# EAGLE design quadparts (EAGLE 8.1.1)
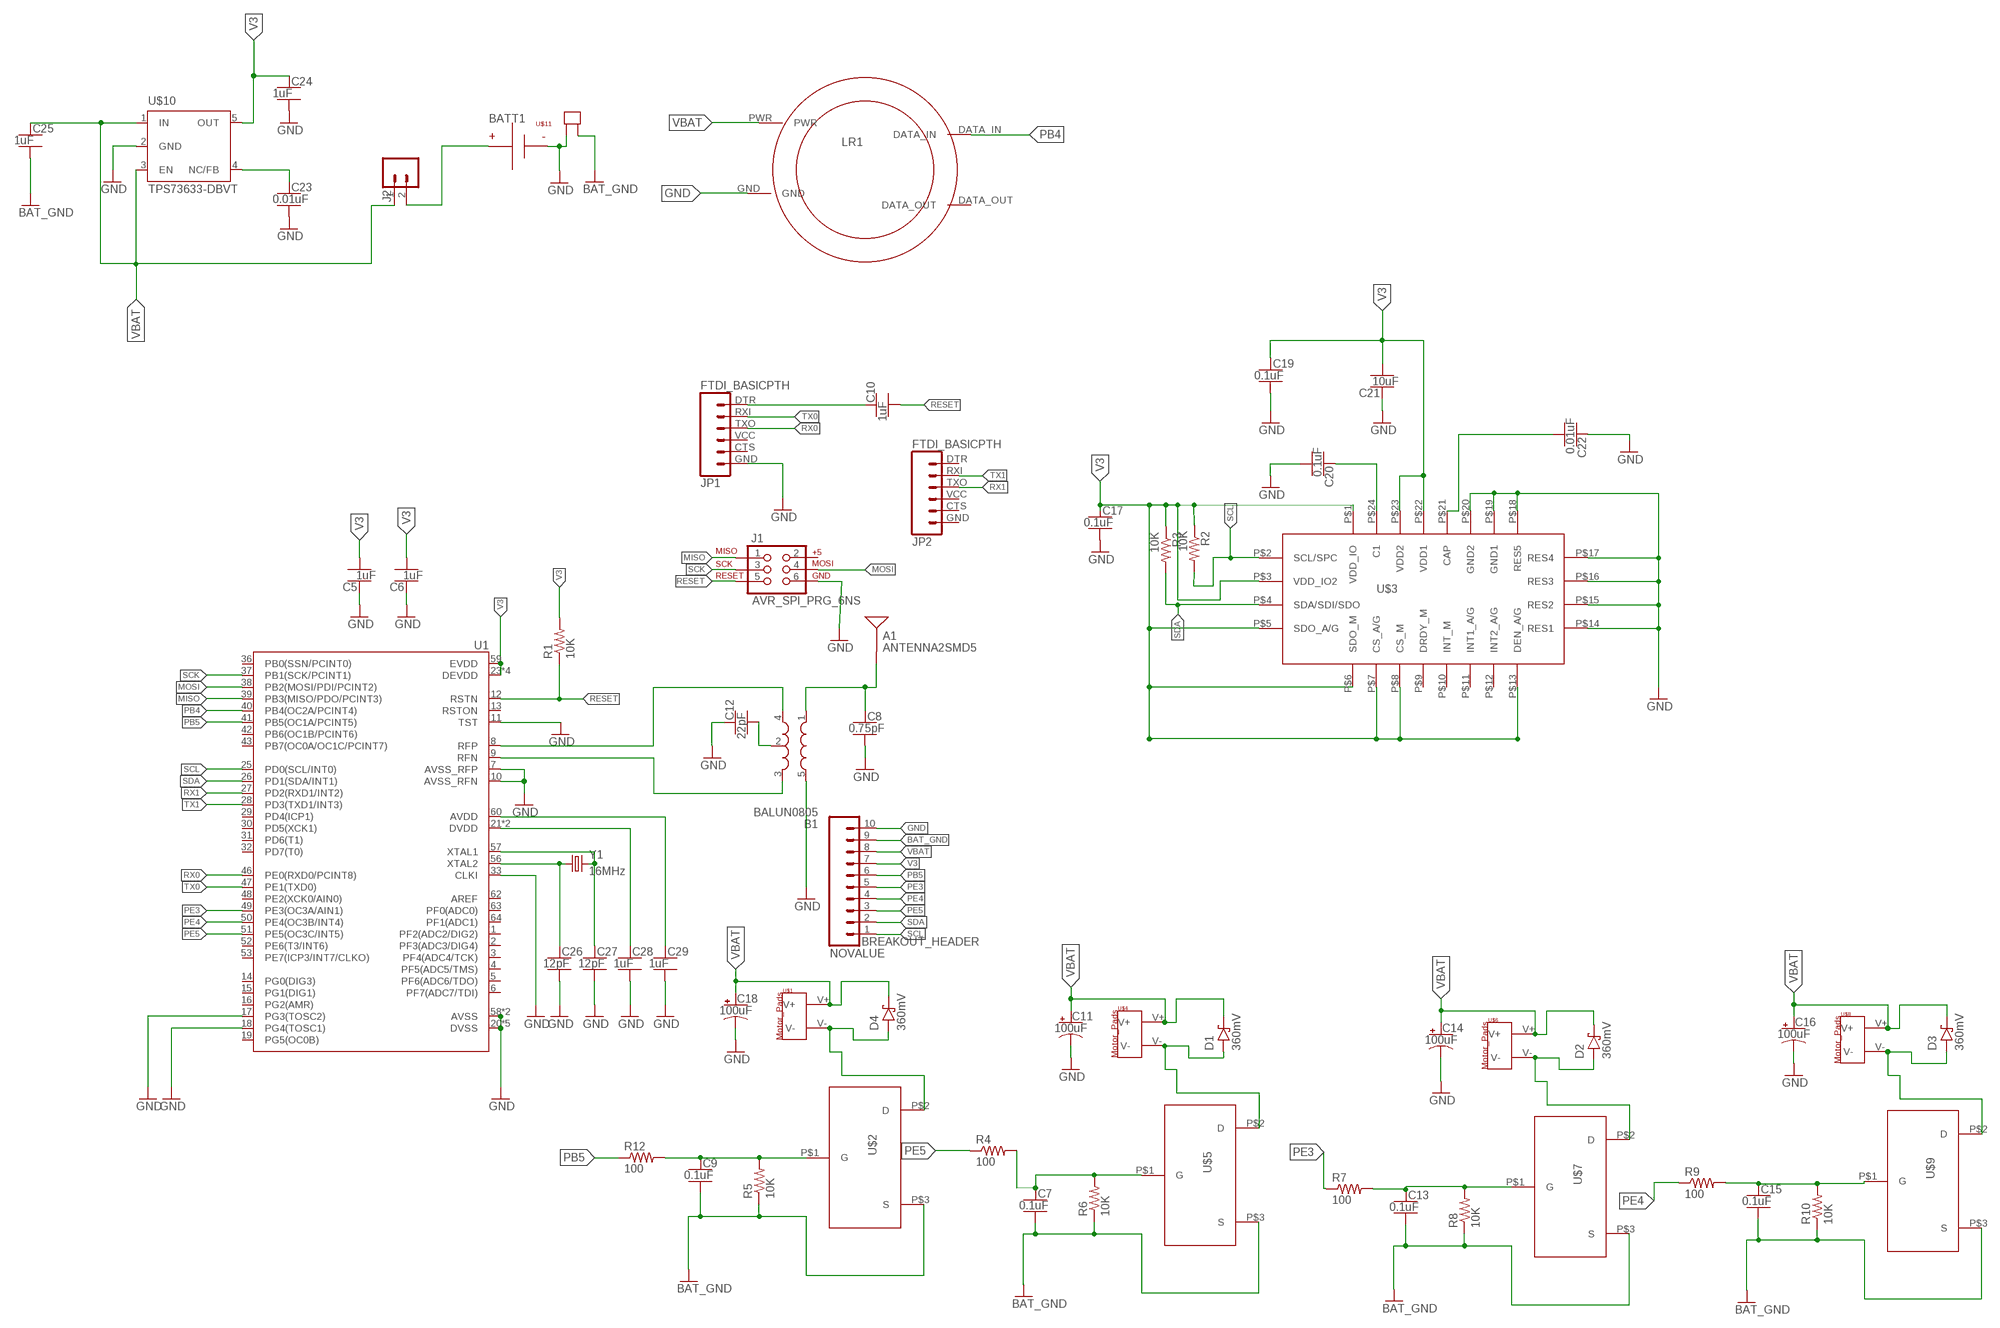
[diagram p0: schematic, sheet 1]

## Parts
A1  ANTENNA2SMD5  [ANTENNA-CHIP5]
B1  BALUN0805  [BALUN]
BATT1  BATTERY-HUBSAN-W/HOLDER  [BATTERY-W/HOLDER-380MAH-HUBSAN]
BREAKOUT_HEADER  NOVALUE  SIP-10_TH-254X10  [HDRV10W63P254_10X1_2540X254H838_HS]
C5  1uF  CAPACITOR-NP_SMD-2012-0805_CERAMIC-1UF  [CAPC2012X140_HS]
C6  1uF  CAPACITOR-NP_SMD-2012-0805_CERAMIC-1UF  [CAPC2012X140_HS]
C7  0.1uF  CERAMIC_CAP-0805-0.1UF  [CERAMIC_CAP_0805]
C8  0.75pF  CAPACITOR-NP_SMD-2012-0805_CERAMIC-0.75PF  [CAPC2012X140_HS]
C9  0.1uF  CERAMIC_CAP-0805-0.1UF  [CERAMIC_CAP_0805]
C10  1uF  CAPACITOR-NP_SMD-2012-0805_CERAMIC-1UF  [CAPC2012X140_HS]
C11  100uF  CAPACITOR-POL_SMD-7043-D_TANTALUM-220UF  [CAPMP7343X310_HS]
C12  22pF  CAPACITOR-NP_SMD-2012-0805_CERAMIC-22PF  [CAPC2012X140_HS]
C13  0.1uF  CERAMIC_CAP-0805-0.1UF  [CERAMIC_CAP_0805]
C14  100uF  CAPACITOR-POL_SMD-7043-D_TANTALUM-220UF  [CAPMP7343X310_HS]
C15  0.1uF  CERAMIC_CAP-0805-0.1UF  [CERAMIC_CAP_0805]
C16  100uF  CAPACITOR-POL_SMD-7043-D_TANTALUM-220UF  [CAPMP7343X310_HS]
C17  0.1uF  CAPACITOR-NP_SMD-2012-0805_CERAMIC-0.1UF  [CAPC2012X140_HS]
C18  100uF  CAPACITOR-POL_SMD-7043-D_TANTALUM-220UF  [CAPMP7343X310_HS]
C19  0.1uF  CAPACITOR-NP_SMD-2012-0805_CERAMIC-0.1UF  [CAPC2012X140_HS]
C20  0.1uF  CAPACITOR-NP_SMD-2012-0805_CERAMIC-0.1UF  [CAPC2012X140_HS]
C21  10uF  CAPACITOR-NP_SMD-2012-0805_CERAMIC-10UF  [CAPC2012X140_HS]
C22  0.01uF  CAPACITOR-NP_SMD-2012-0805_CERAMIC-0.01UF  [CAPC2012X140_HS]
C23  0.01uF  CAPACITOR-NP_SMD-2012-0805_CERAMIC-0.01UF  [CAPC2012X140_HS]
C24  1uF  CAPACITOR-NP_SMD-2012-0805_CERAMIC-1UF  [CAPC2012X140_HS]
C25  1uF  CAPACITOR-NP_SMD-2012-0805_CERAMIC-1UF  [CAPC2012X140_HS]
C26  12pF  CAPACITOR-NP_SMD-2012-0805_CERAMIC-12PF  [CAPC2012X140_HS]
C27  12pF  CAPACITOR-NP_SMD-2012-0805_CERAMIC-12PF  [CAPC2012X140_HS]
C28  1uF  CAPACITOR-NP_SMD-2012-0805_CERAMIC-1UF  [CAPC2012X140_HS]
C29  1uF  CAPACITOR-NP_SMD-2012-0805_CERAMIC-1UF  [CAPC2012X140_HS]
D1  360mV  DIODE-SCHOTTKY_SMD-SOD123-360MV  [SOD3716X135_HS]
D2  360mV  DIODE-SCHOTTKY_SMD-SOD123-360MV  [SOD3716X135_HS]
D3  360mV  DIODE-SCHOTTKY_SMD-SOD123-360MV  [SOD3716X135_HS]
D4  360mV  DIODE-SCHOTTKY_SMD-SOD123-360MV  [SOD3716X135_HS]
J1  AVR_SPI_PRG_6NS  [2X3-NS]
J2  MALE_HEADER_2POS-2X1-0.1IN  [MALE_HEADER_2X1_0.1IN]
JP1  FTDI_BASICPTH  [FTDI_BASIC]
JP2  FTDI_BASICPTH  [FTDI_BASIC]
LR1  LED_RING  [LED_RING]
R1  10K  RESISTOR_SMD-2012-0805-10K  [RESC2012X60_HS]
R2  10K  RESISTOR_SMD-2012-0805-10K  [RESC2012X60_HS]
R3  10K  RESISTOR_SMD-2012-0805-10K  [RESC2012X60_HS]
R4  100  RESISTOR_SMD-2012-0805-100  [RESC2012X60_HS]
R5  10K  RESISTOR_SMD-2012-0805-10K  [RESC2012X60_HS]
R6  10K  RESISTOR_SMD-2012-0805-10K  [RESC2012X60_HS]
R7  100  RESISTOR_SMD-2012-0805-100  [RESC2012X60_HS]
R8  10K  RESISTOR_SMD-2012-0805-10K  [RESC2012X60_HS]
R9  100  RESISTOR_SMD-2012-0805-100  [RESC2012X60_HS]
R10  10K  RESISTOR_SMD-2012-0805-10K  [RESC2012X60_HS]
R12  100  RESISTOR_SMD-2012-0805-100  [RESC2012X60_HS]
U1  ATMEGA128RFA1  [QFN-64]
U$1  MOTOR_PADS  [MOTOR_PADS]
U$2  N-CHANNEL_MOSFET  [N-CHANNELMOFSET]
U$3  9-AXIS_IMU  [9-AXIS_IMU]
U$4  MOTOR_PADS  [MOTOR_PADS]
U$5  N-CHANNEL_MOSFET  [N-CHANNELMOFSET]
U$6  MOTOR_PADS  [MOTOR_PADS]
U$7  N-CHANNEL_MOSFET  [N-CHANNELMOFSET]
U$8  MOTOR_PADS  [MOTOR_PADS]
U$9  N-CHANNEL_MOSFET  [N-CHANNELMOFSET]
U$10  TPS73633-DBVT  [SOT23-DBV]
U$11  NET_BRIDGE  [NET_BRIDGE]
Y1  16MHz  CRYSTAL5X3  [CRYSTAL-SMD-5X3]

## Nets
BAT_GND: BREAKOUT_HEADER.9 C7.2 C9.2 C13.2 C15.2 C25.2 R5.1 R6.1 R8.1 R10.1 U$2.P$3(S) U$5.P$3(S) U$7.P$3(S) U$9.P$3(S) U$11.P$2
GND: B1.5(GND) BATT1.-(N) BREAKOUT_HEADER.10 C5.1 C6.1 C8.2 C11.2(-) C12.1 C14.2(-) C16.2(-) C17.2 C18.2(-) C19.2 C20.2 C21.1 C22.1 C23.2 C24.2 C26.2 C27.2 C28.2 C29.2 J1.6 JP1.GND LR1.GND U1.7(AVSS_RFP) U1.10(AVSS_RFN) U1.11(TST) U1.17(PG3(TOSC2)) U1.18(PG4(TOSC1)) U1.20(DVSS) U1.24(DVSS) U1.33(CLKI) U1.35(DVSS) U1.45(DVSS) U1.55(DVSS) U1.58(AVSS) U1.61(AVSS) U$3.P$14(RES1) U$3.P$15(RES2) U$3.P$16(RES3) U$3.P$17(RES4) U$3.P$18(RES5) U$3.P$19(GND1) U$3.P$20(GND2) U$10.2(GND) U$11.P$1
MISO: J1.1 U1.39(PB3(MISO/PDO/PCINT3))
MOSI: J1.4 U1.38(PB2(MOSI/PDI/PCINT2))
N$1: C9.1 R5.2 R12.2 U$2.P$1(G)
N$2: C7.1 R4.2 R6.2 U$5.P$1(G)
N$4 [RFSIG]: A1.FEED(SIGNAL) B1.1(IN) C8.1
N$8: B1.2(GND) C12.2
N$10: C10.1 JP1.DTR
N$13: D1.A U$4.V- U$5.P$2(D)
N$14: C13.1 R7.2 R8.2 U$7.P$1(G)
N$16: D4.A U$1.V- U$2.P$2(D)
N$17 [HIGHCURRENT]: D2.A U$6.V- U$7.P$2(D)
N$18: C15.1 R9.2 R10.2 U$9.P$1(G)
N$19: D3.A U$8.V- U$9.P$2(D)
N$21: C20.1 U$3.P$24(C1)
N$23: C22.2 U$3.P$21(CAP)
N$24: C26.1 U1.56(XTAL2) Y1.1
N$25: BATT1.+(P) J2.2
N$26: C16.1(+) D3.C U$8.V+
N$27: C23.1 U$10.4(NC/FB)
N$36: B1.4(OUT1) U1.8(RFP)
N$37: B1.3(OUT2) U1.9(RFN)
N$40: C29.1 U1.60(AVDD)
N$41: C28.1 U1.21(DVDD) U1.22(DVDD)
N$43: C27.1 U1.57(XTAL1) Y1.3
PB4: LR1.DATA_IN U1.40(PB4(OC2A/PCINT4))
PB5: BREAKOUT_HEADER.6 R12.1 U1.41(PB5(OC1A/PCINT5))
PE3: BREAKOUT_HEADER.5 R7.1 U1.49(PE3(OC3A/AIN1))
PE4: BREAKOUT_HEADER.4 R9.1 U1.50(PE4(OC3B/INT4))
PE5: BREAKOUT_HEADER.3 R4.1 U1.51(PE5(OC3C/INT5))
RESET: C10.2 J1.5 R1.1 U1.12(RSTN)
RX0: JP1.TXO U1.46(PE0(RXD0/PCINT8))
RX1: JP2.TXO U1.27(PD2(RXD1/INT2))
SCK: J1.3 U1.37(PB1(SCK/PCINT1))
SCL: BREAKOUT_HEADER.1 R2.2 U1.25(PD0(SCL/INT0)) U$3.P$2(SCL/SPC)
SDA: BREAKOUT_HEADER.2 R3.2 U1.26(PD1(SDA/INT1)) U$3.P$4(SDA/SDI/SDO)
TX0: JP1.RXI U1.47(PE1(TXD0))
TX1: JP2.RXI U1.28(PD3(TXD1/INT3))
V3: BREAKOUT_HEADER.7 C5.2 C6.2 C17.1 C19.1 C21.2 C24.1 R1.2 R2.1 R3.1 U1.23(DEVDD) U1.34(DEVDD) U1.44(DEVDD) U1.54(DEVDD) U1.59(EVDD) U$3.P$1(VDD_IO) U$3.P$3(VDD_IO2) U$3.P$5(SDO_A/G) U$3.P$6(SDO_M) U$3.P$7(CS_A/G) U$3.P$8(CS_M) U$3.P$13(DEN_A/G) U$3.P$22(VDD1) U$3.P$23(VDD2) U$10.5(OUT)
VBAT [HIGHCURRENT]: BREAKOUT_HEADER.8 C11.1(+) C14.1(+) C18.1(+) C25.1 D1.C D2.C D4.C J2.1 LR1.PWR U$1.V+ U$4.V+ U$6.V+ U$10.1(IN) U$10.3(EN)
Unconnected: J1.2 JP1.CTS JP1.VCC JP2.CTS JP2.DTR JP2.GND JP2.VCC LR1.DATA_OUT U1.1(PF2(ADC2/DIG2)) U1.2(PF3(ADC3/DIG4)) U1.3(PF4(ADC4/TCK)) U1.4(PF5(ADC5/TMS)) U1.5(PF6(ADC6/TDO)) U1.6(PF7(ADC7/TDI)) U1.13(RSTON) U1.14(PG0(DIG3)) U1.15(PG1(DIG1)) U1.16(PG2(AMR)) U1.19(PG5(OC0B)) U1.29(PD4(ICP1)) U1.30(PD5(XCK1)) U1.31(PD6(T1)) U1.32(PD7(T0)) U1.36(PB0(SSN/PCINT0)) U1.42(PB6(OC1B/PCINT6)) U1.43(PB7(OC0A/OC1C/PCINT7)) U1.48(PE2(XCK0/AIN0)) U1.52(PE6(T3/INT6)) U1.53(PE7(ICP3/INT7/CLKO)) U1.62(AREF) U1.63(PF0(ADC0)) U1.64(PF1(ADC1)) U$3.P$9(DRDY_M) U$3.P$10(INT_M) U$3.P$11(INT1_A/G) U$3.P$12(INT2_A/G)

## Library data of the parts
A1 = quadparts_prebuilt:ANTENNA2: Chip antenna Single endded antenna. Common with smaller chip antennas. CHIP4 package is the GPS Chip Antenna SKU: GPS-08418. CHIP5 package is 2.4GHz chip antenna SKU: WRL-00144.; DATASHEET: http://www.linxtechnologies.com/resources/data-guides/ant-xxx-chp-x.pdf; DIST: Digikey; DISTPN: ANT-2.45-CHPCT-ND; MFR: Linx Technologies Inc.; MPN: ANT-2.45-CHP-T; PRICE: 3.16
B1 = quadparts_prebuilt:BALUN: 0805 footprint balun- Ember 351/357; DATASHEET: http://katalog.we-online.de/pbs/datasheet/748421245.pdf; DIST: Digikey; DISTPN: 732-2230-6-ND; MFR: Wurth Electronics Inc; MPN: 748421245; PRICE: 2.63
BATT1 = quadparts_prebuilt:BATTERY; CREATOR: Swanson; DIST: AMAZON; DISTPN: http://www.amazon.com/dp/B00RROB6Q4?smid=AMNTPWSAB5H0S; MFR: HUBSAN; MPN: X4-H107C-8-in-1
BREAKOUT_HEADER = quadparts_prebuilt:SIP-10_: 10 pin single inline pin header, socket, or connector; DATASHEET: http://portal.fciconnect.com/Comergent//fci/drawing/68000.pdf; DIST: Digikey; DISTPN: 609-3250-ND; MFR: Amphenol FCI; MPN: 68000-110HLF; PRICE: 0.55
C5 C6 C10 C24 C25 C28 C29 = quadparts_prebuilt:CAPACITOR-NP_: Nonpolarized capacitor; DIST: Digikey; DISTPN: 490-4736-1-ND; MFR: Murata Electronics North America; MPN: GRM21BR71H105KA12L
C7 C9 C13 C15 = quadparts_Jason:CERAMIC_CAP: Nonpolarized capacitor; CREATOR: SWANSON; DIST: Digikey; DISTPN: 490-1666-1-ND; MFR: Murata Electronics North America; MPN: GRM21BR71H104KA01L
C8 = quadparts_prebuilt:CAPACITOR-NP_: Nonpolarized capacitor; DIST: Digikey; DISTPN: 490-3585-1-ND; MFR: Murata Electronics North America; MPN: GQM2195C2AR75CB01D
C11 C14 C16 C18 = quadparts_prebuilt:CAPACITOR-POL_: Polarized capacitor; DIST: Digikey; DISTPN: 478-8912-1-ND; MFR: AVX Corporation; MPN: TAJD227K006RNJ; VALUE: 220uF
C12 = quadparts_prebuilt:CAPACITOR-NP_: Nonpolarized capacitor; DIST: Digikey; DISTPN: 490-5534-1-ND; MFR: Murata Electronics North America; MPN: GRM21A5C2E220JW01D
C17 C19 C20 = quadparts_prebuilt:CAPACITOR-NP_: Nonpolarized capacitor; DIST: Digikey; DISTPN: 490-1666-1-ND; MFR: Murata Electronics North America; MPN: GRM21BR71H104KA01L
C21 = quadparts_prebuilt:CAPACITOR-NP_: Nonpolarized capacitor; DIST: Digikey; DISTPN: 490-5523-1-ND; MFR: Murata Electronics North America; MPN: GRM21BR61E106KA73L
C22 C23 = quadparts_prebuilt:CAPACITOR-NP_: Nonpolarized capacitor; DIST: Digikey; DISTPN: 490-8295-1-ND; MFR: Murata Electronics North America; MPN: GRM2195C1H103FA01D
C26 C27 = quadparts_prebuilt:CAPACITOR-NP_: Nonpolarized capacitor; DIST: Digikey; DISTPN: 490-5531-1-ND; MFR: Murata Electronics North America; MPN: GRM21A5C2E120JW01D
D1-D4 = quadparts_prebuilt:DIODE-SCHOTTKY_: Schottky diode; DIST: Digikey; DISTPN: CRS08QMCT-ND; MFR: Toshiba Semiconductor and Storage; MPN: CRS08(TE85L,Q,M)
J1 = quadparts_prebuilt:AVR_SPI_PRG_6: AVR ISP 6 Pin This is the reduced ISP connector for AVR programming. Common on Arduino. This footprint will take up less PCB space and can be used with a 10-pin to 6-pin adapter such as SKU: BOB-08508; DATASHEET: http://portal.fciconnect.com/Comergent//fci/drawing/67996.pdf; DIST: Digikey; DISTPN: 609-3234-ND; MFR: Amphenol FCI; MPN: 67997-206HLF; PRICE: 0.31
J2 = quadparts_Jason:MALE_HEADER_2POS: 2 pin single inline pin header, socket, or connector; CREATOR: SWANSON; DIST: Digikey; DISTPN: 3M9447-ND; MFR: 3M; MPN: 961102-6404-AR
JP1 JP2 = quadparts_prebuilt:FTDI_BASIC: FTDI Basic header with labels; DATASHEET: http://portal.fciconnect.com/Comergent//fci/drawing/68015.pdf; DIST: Digikey; DISTPN: 609-3327-ND; MFR: Amphenol FCI; MPN: 68016-406HLF; PRICE: 0.33
LR1 = LEDs:LED_RING
R1-R3 R5 R6 R8 R10 = quadparts_prebuilt:RESISTOR_: Resistor; DIST: Digikey; DISTPN: 311-10KARCT-ND; MFR: Yageo; MPN: RC0805JR-0710KL
R4 R7 R9 R12 = quadparts_prebuilt:RESISTOR_: Resistor; DIST: Digikey; DISTPN: 311-100ARCT-ND; MFR: Yageo; MPN: RC0805JR-07100RL
U1 = quadparts_prebuilt:ATMEGA128RFA1: ATmega128RFA1 8-bit AVR Microcontroller with Low Power 2.4GHz Transceiver for ZigBee and IEEE 802.15.4; CREATOR: Swanson; DATASHEET: http://www.atmel.com/Images/Atmel-8266-MCU_Wireless-ATmega128RFA1_Datasheet.pdf; DIST: Digikey; DISTPN: ATMEGA128RFA1-ZUR00DKR-ND; MFR: Atmel; MPN: ATMEGA128RFA1-ZUR00; PRICE: 10.21
U$1 U$4 U$6 U$8 = quadparts_prebuilt:MOTOR_PADS; DIST: NA; DISTPN: NA; MFR: NA; MPN: NA
U$2 U$5 U$7 U$9 = quadparts_Jason:N-CHANNEL_MOSFET; CREATOR: Jason_Wong; DIST: Digikey; DISTPN: SI2302CDS-T1-E3CT-ND; MFR: Vishay Siliconix; MPN: SI2302CDS-T1-E3
U$3 = quadparts_Jason:9-AXIS_IMU; CREATOR: Jason_Wong; DIST: Digikey; DISTPN: 497-14946-1-ND; MFR: STMicroelectronics; MPN: LSM9DS1TR
U$10 = quadparts_prebuilt:TPS73633-DBVT; DATASHEET: http://www.ti.com/lit/ds/symlink/lp3985.pdf; DIST: Digikey; DISTPN: LP3985IM5X-3.0/NOPBCT-ND; MFR: Texas Instruments; MPN: LP3985IM5X-3.0/NOPB; PRICE: 0.59
U$11 = quadparts_Zhe:NET_BRIDGE
Y1 = quadparts_prebuilt:CRYSTAL: Various standard crystals. Proven footprints.; DATASHEET: http://www.abracon.com/Resonators/abm3b.pdf; DIST: Digikey; DISTPN: 535-9122-1-ND; MFR: Abracon LLC; MPN: ABM3B-16.000MHZ-B2-T; PRICE: 0.68; PROD_ID: XTAL-08218

## Net classes
1 RFSIG: width 0.457 mm
2 HIGHCURRENT: width 0.457 mm

## Board
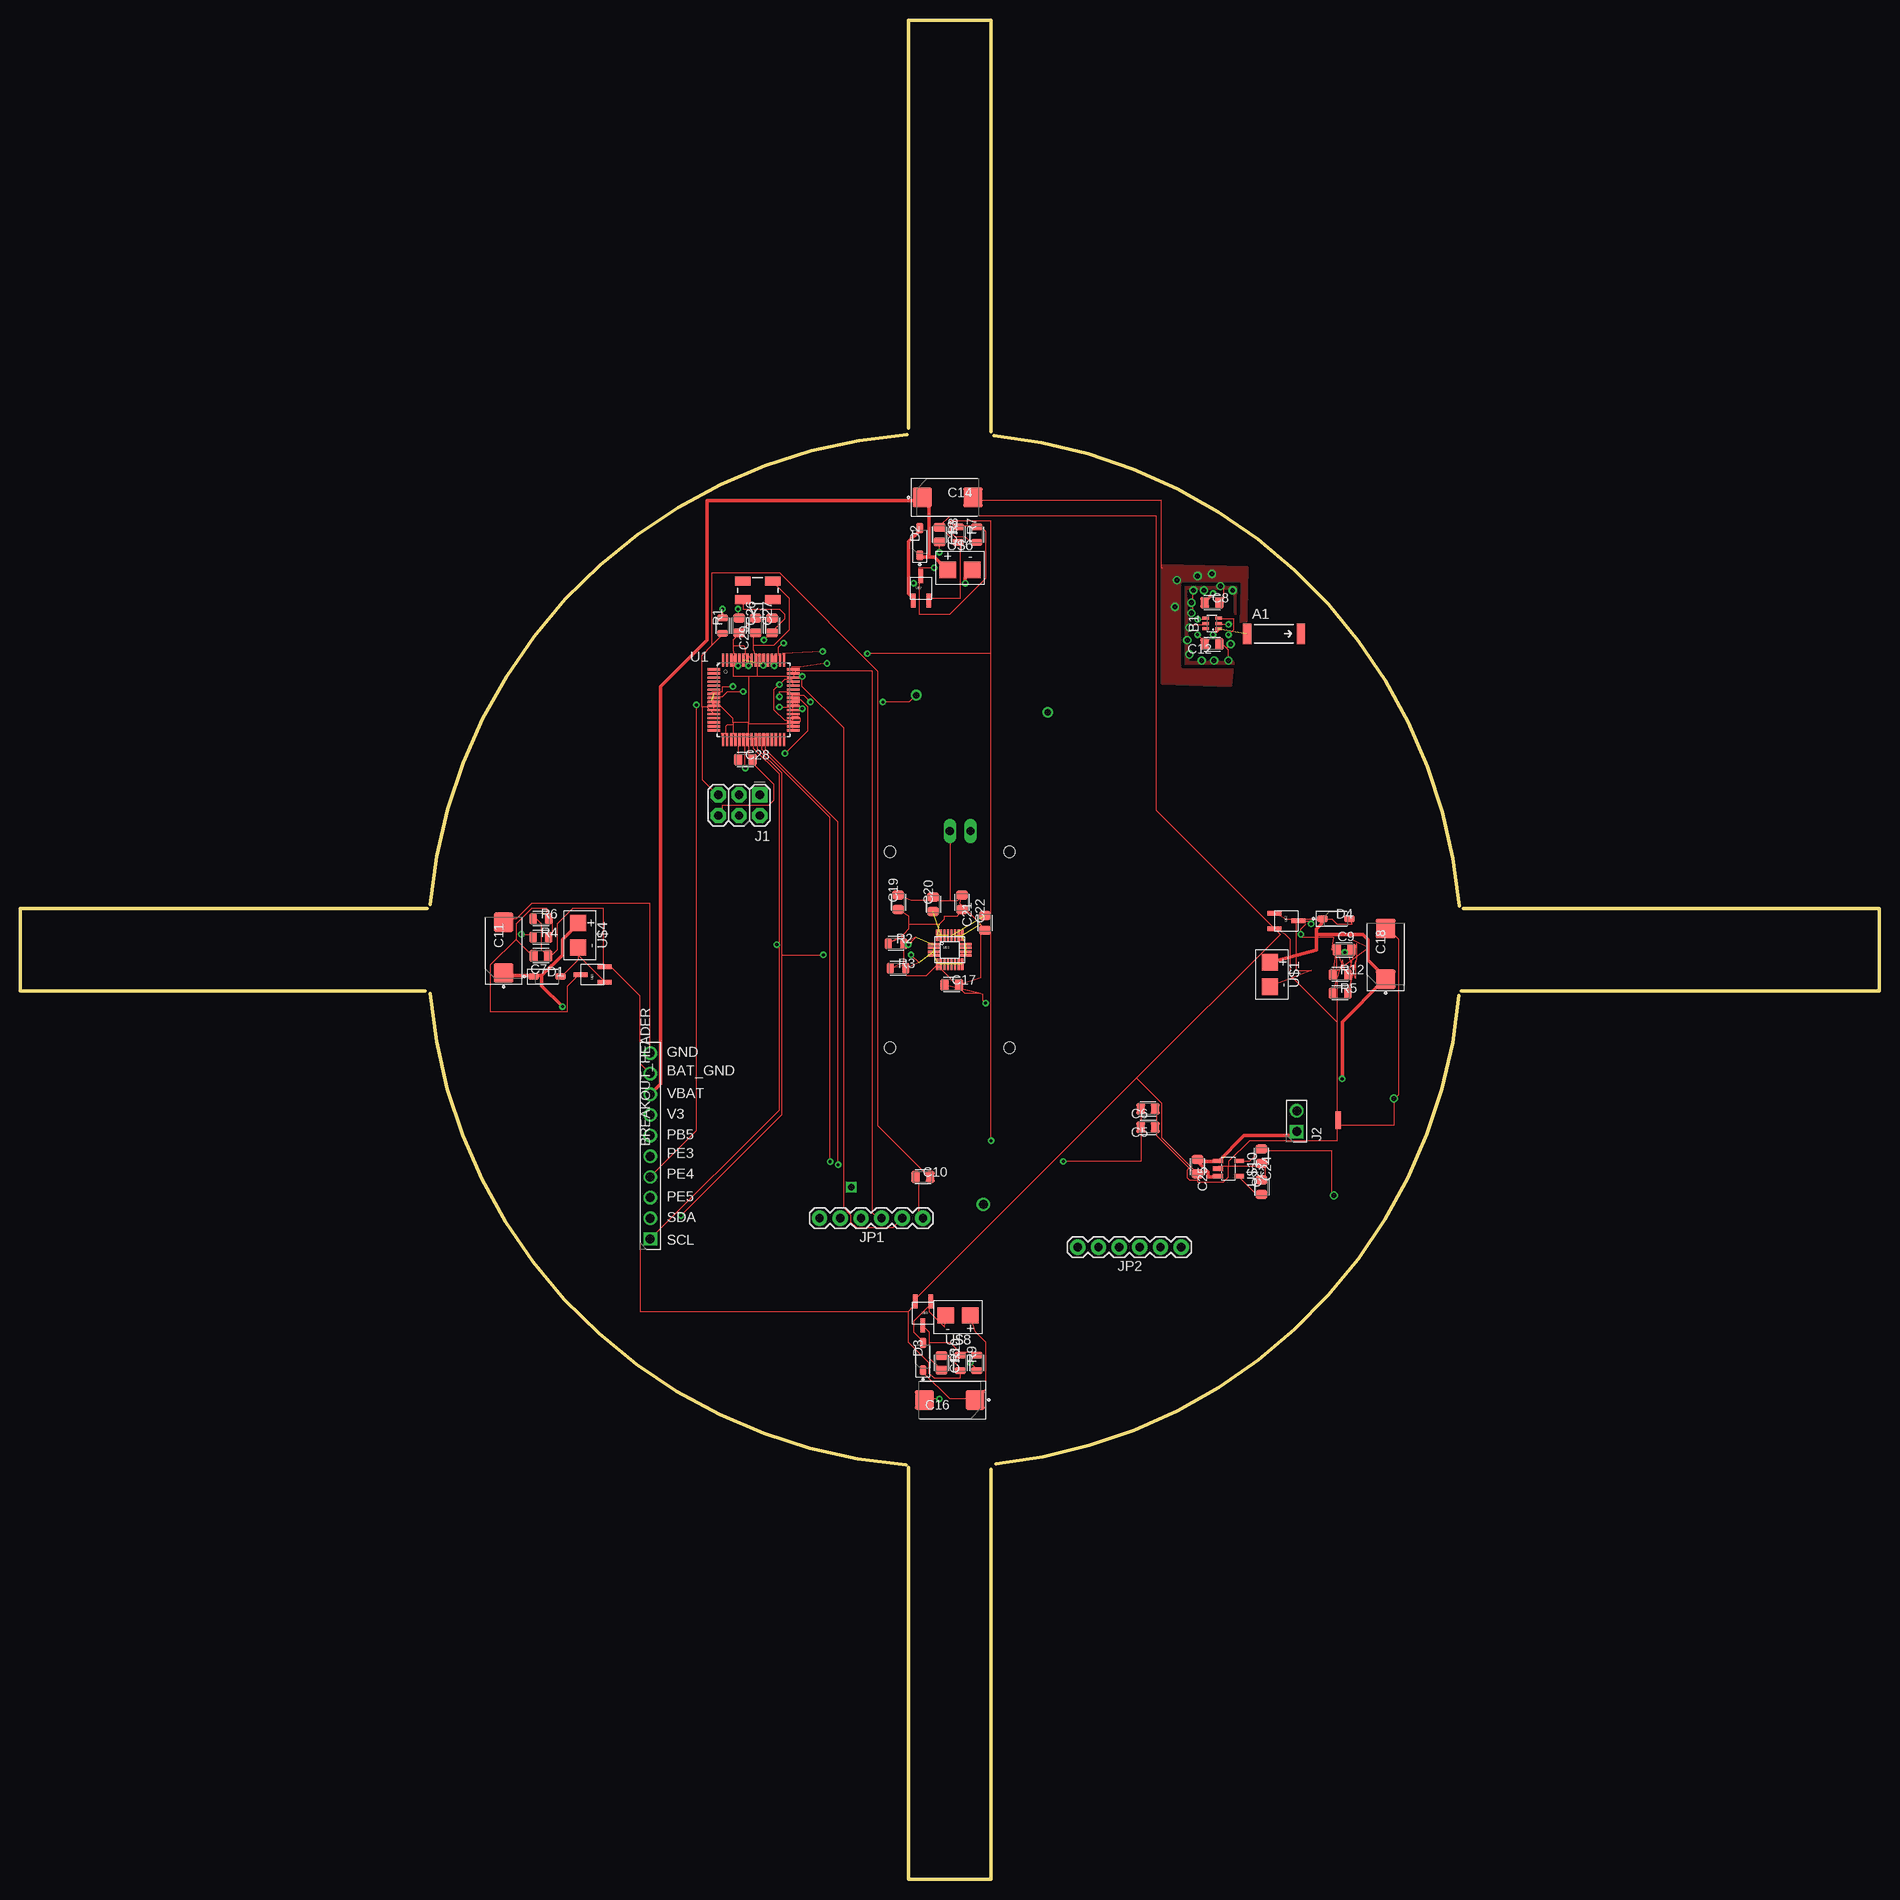
[diagram p1: board, top side]
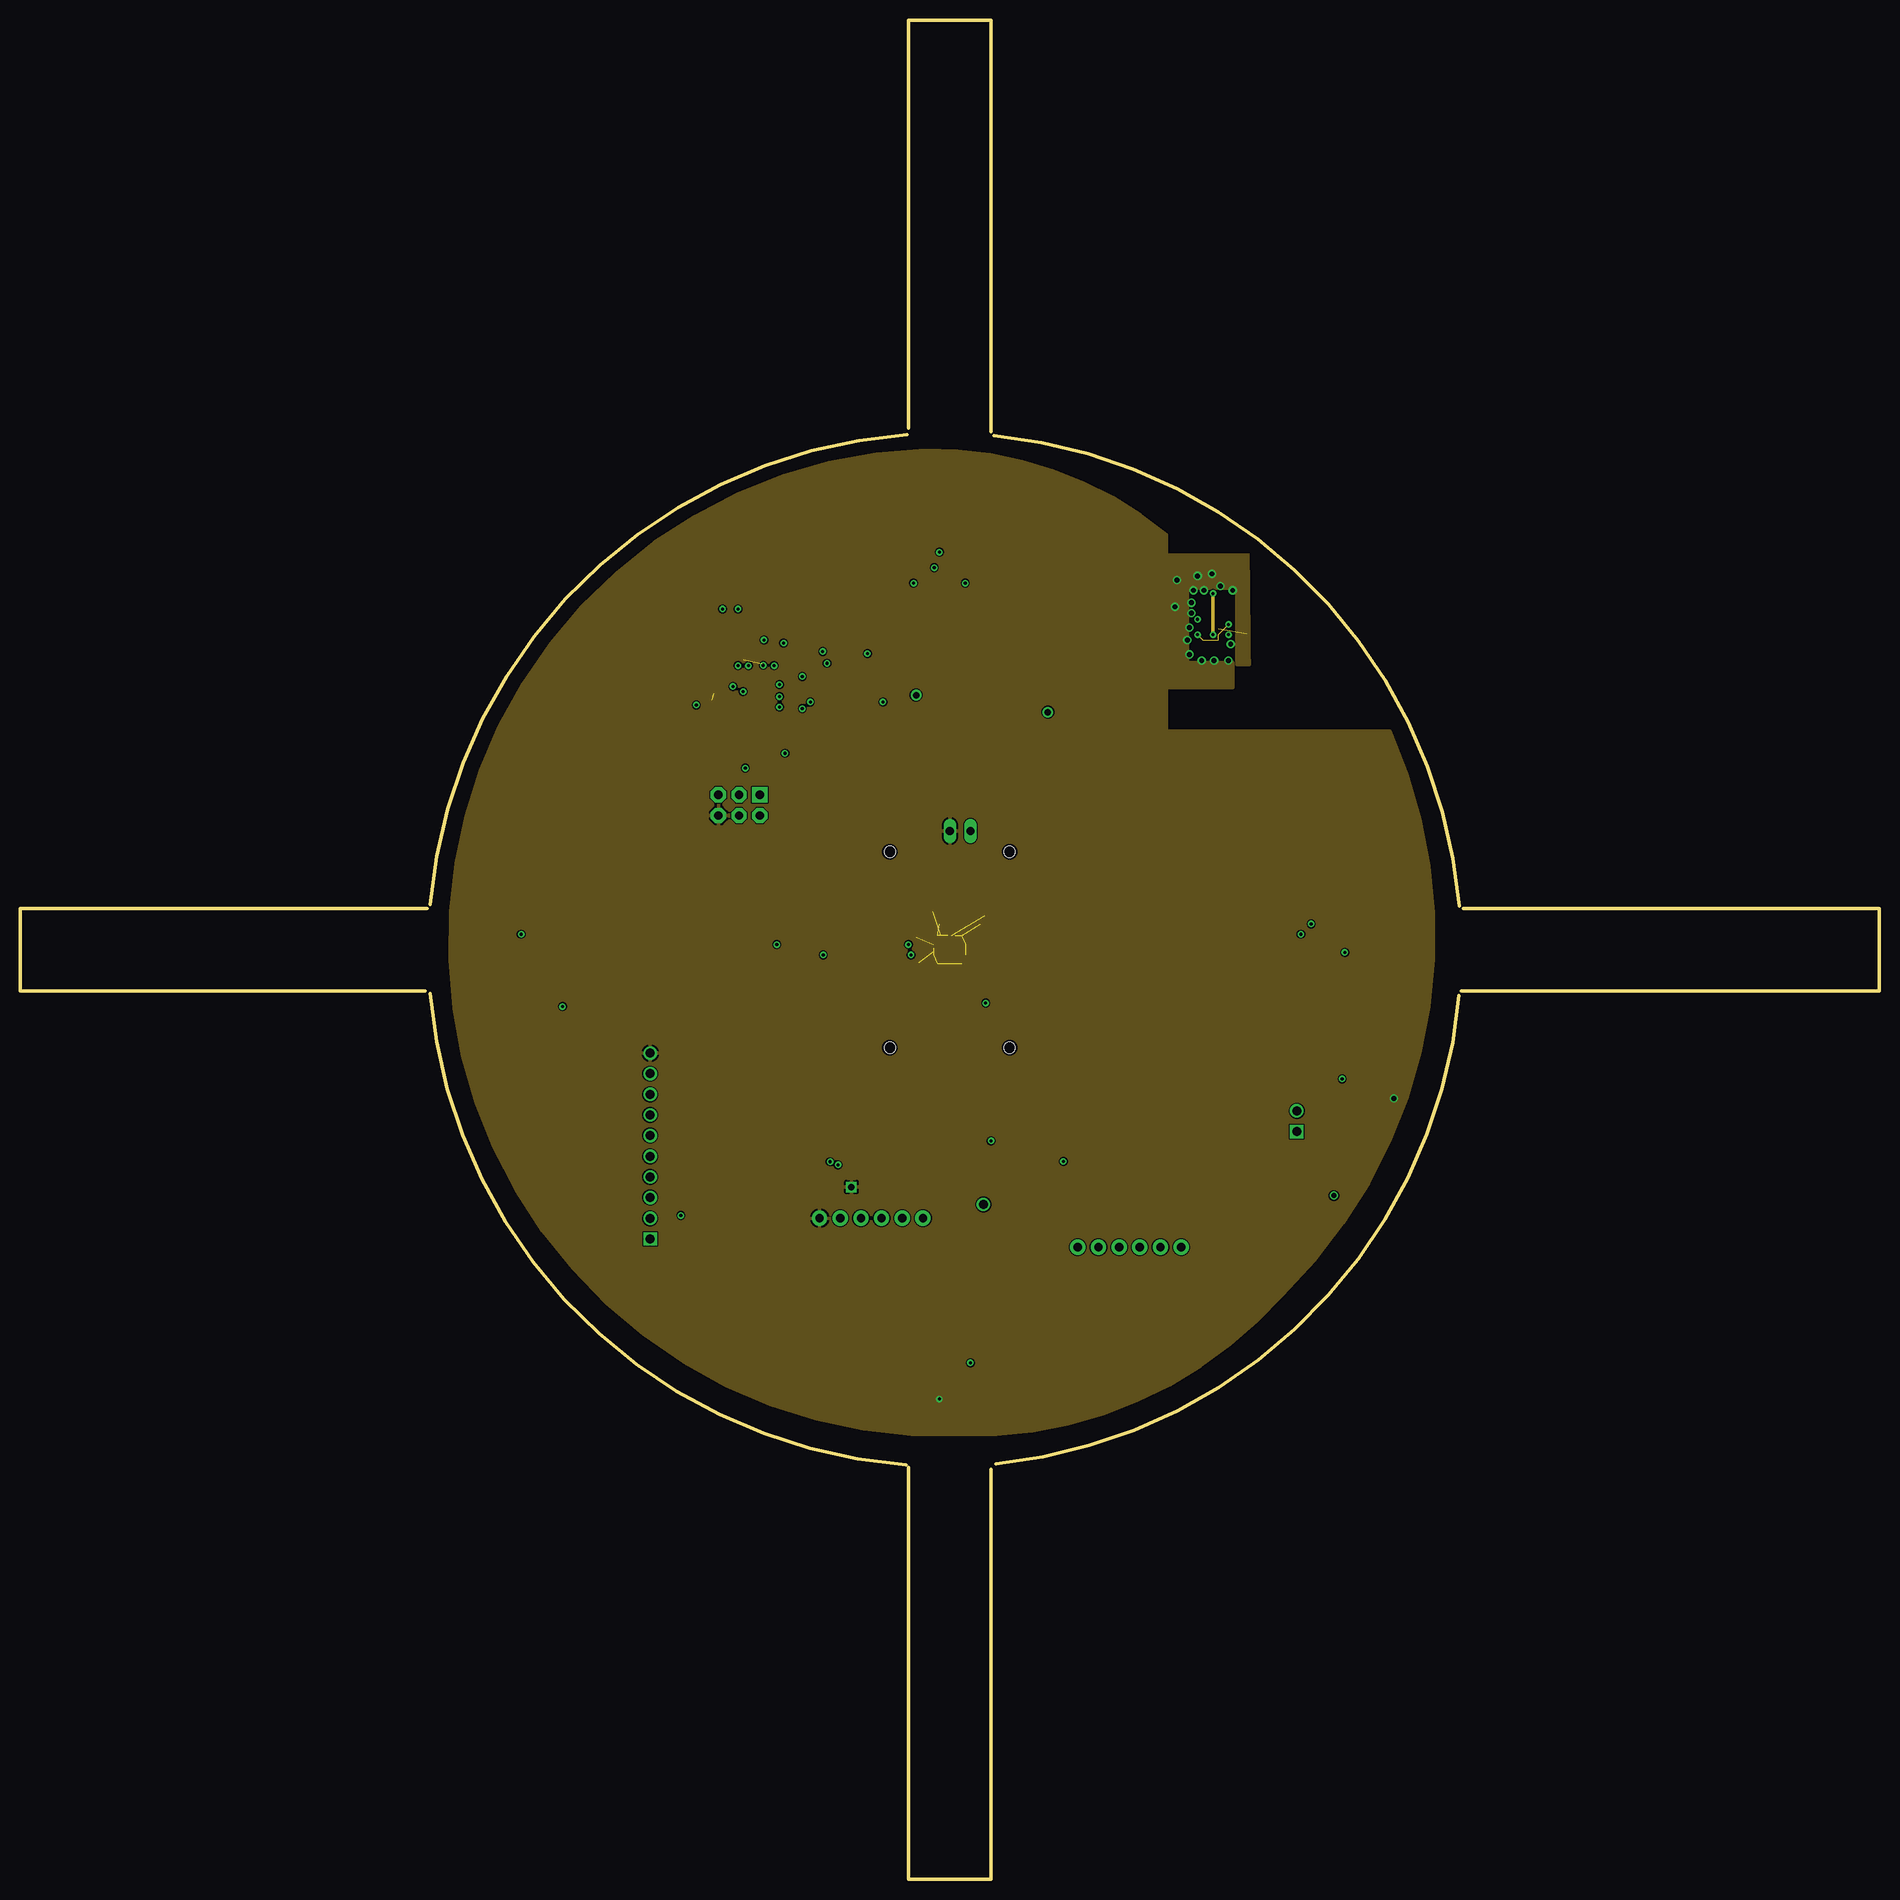
[diagram p2: board, inner layer Route2]
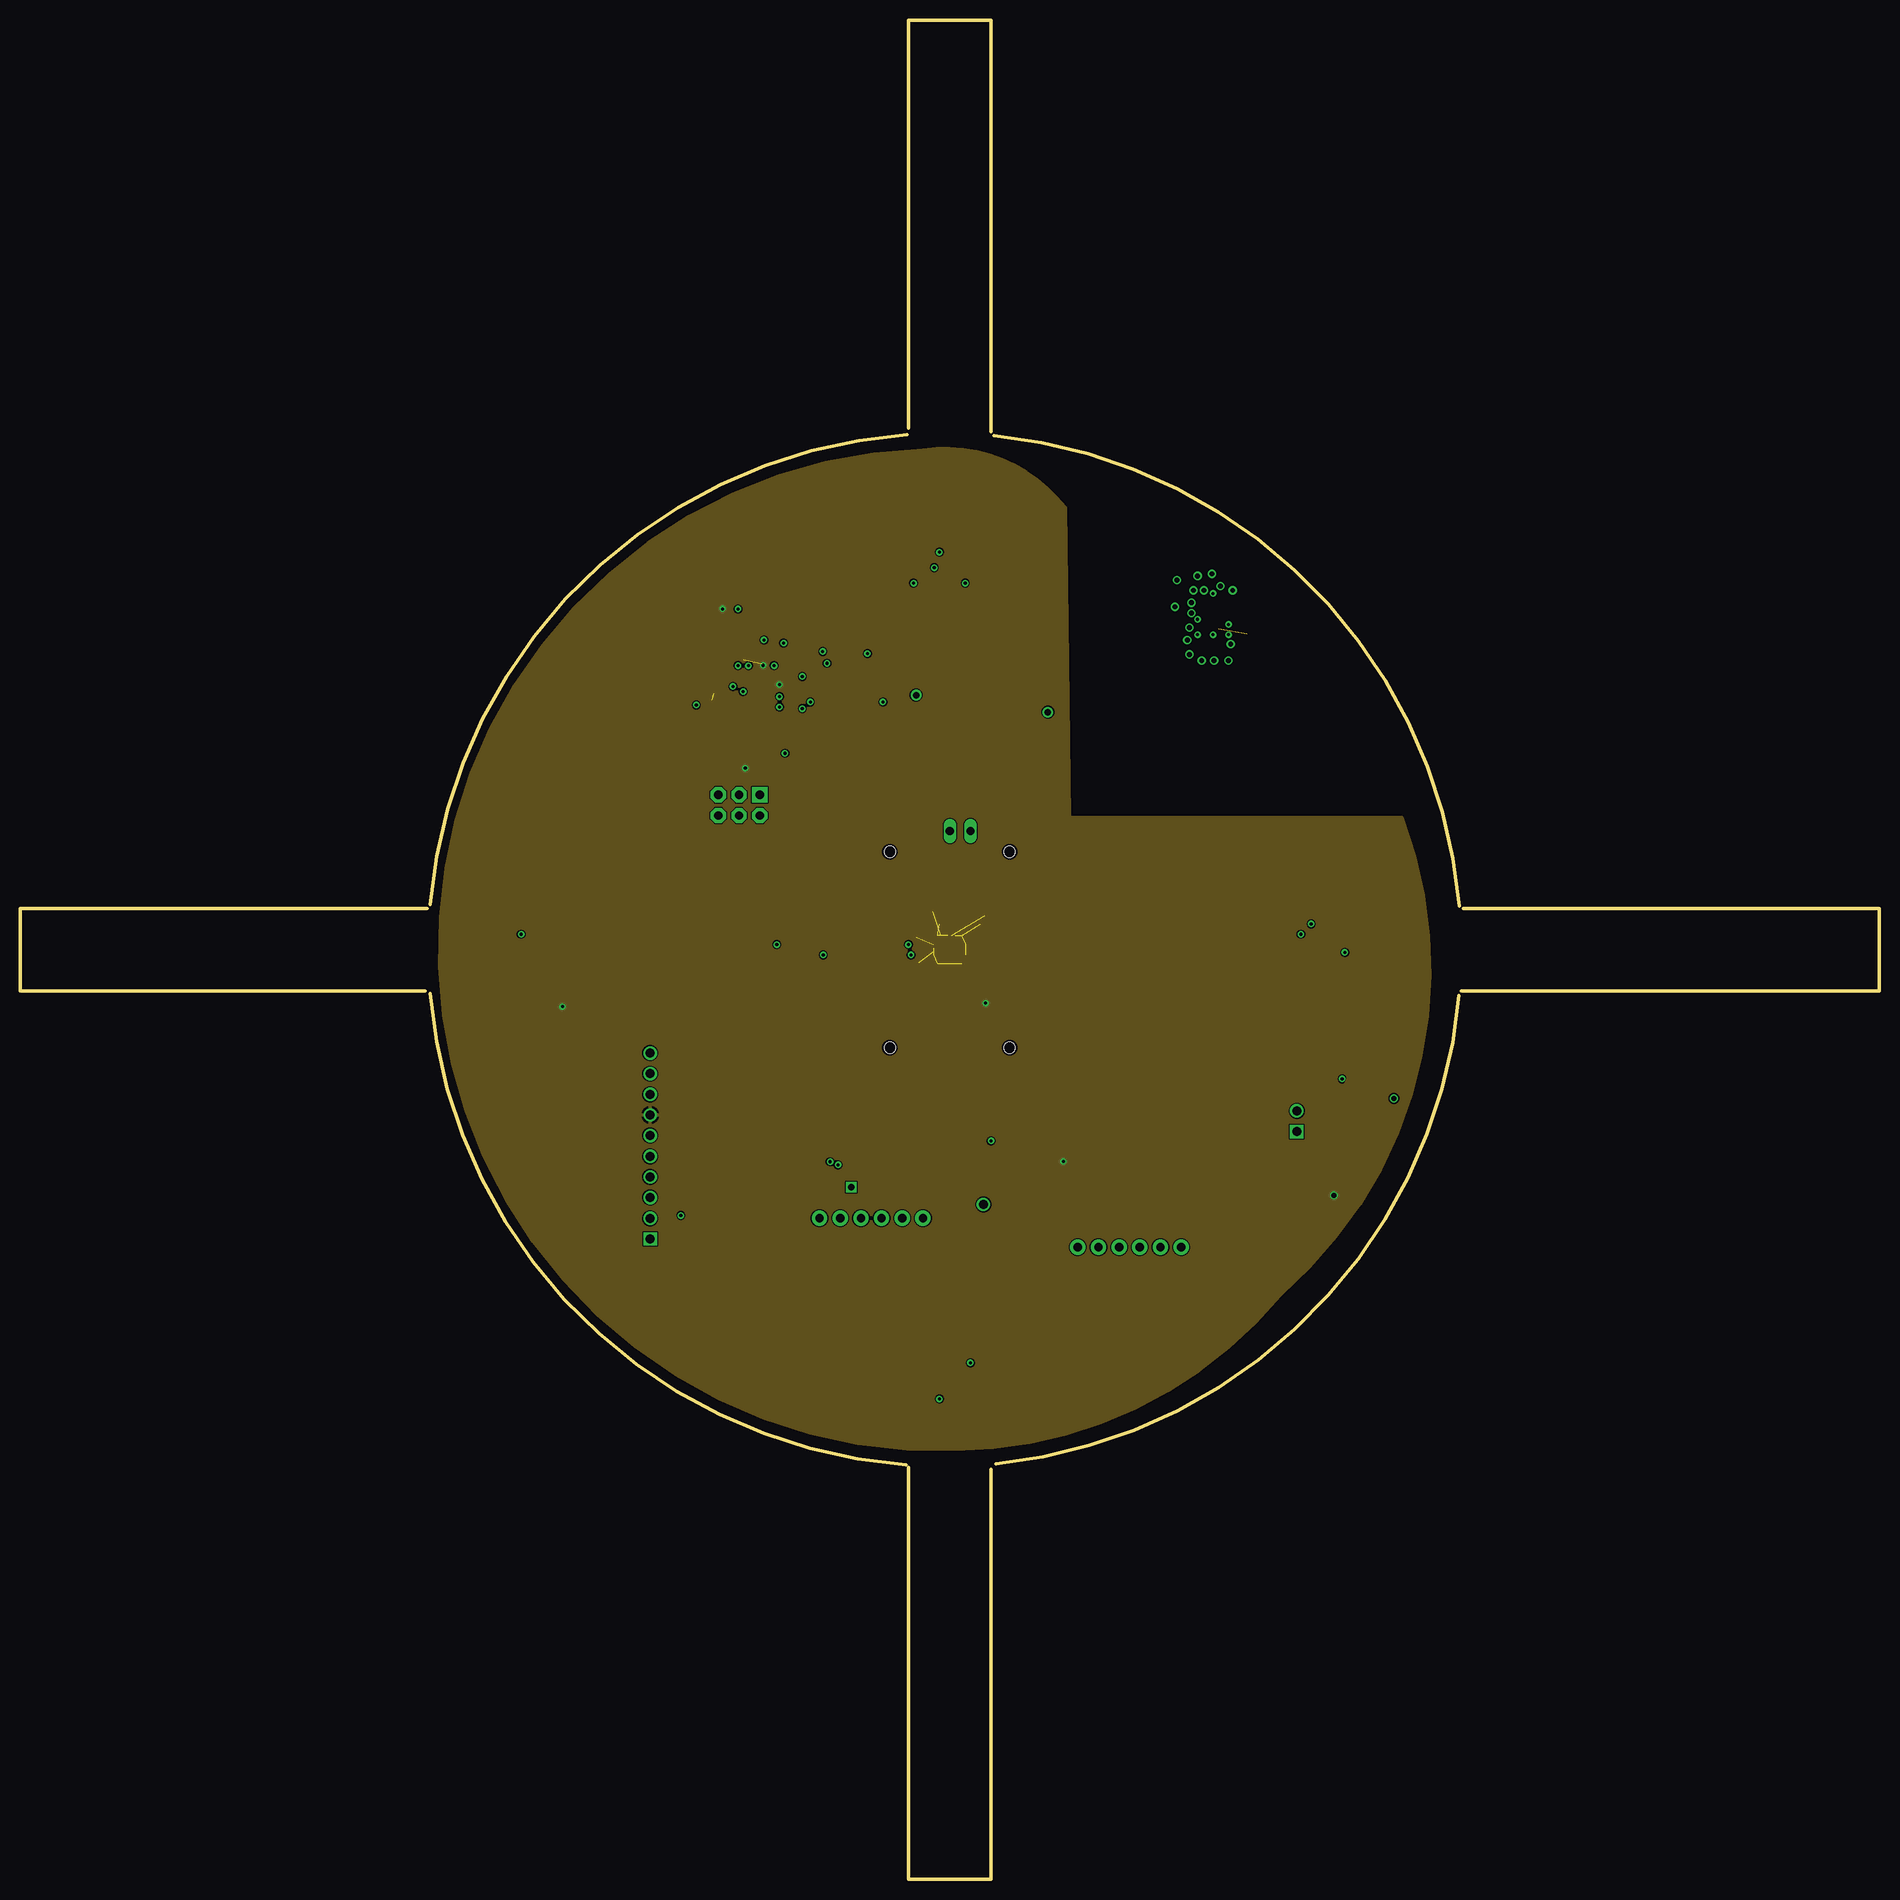
[diagram p3: board, inner layer Route15]
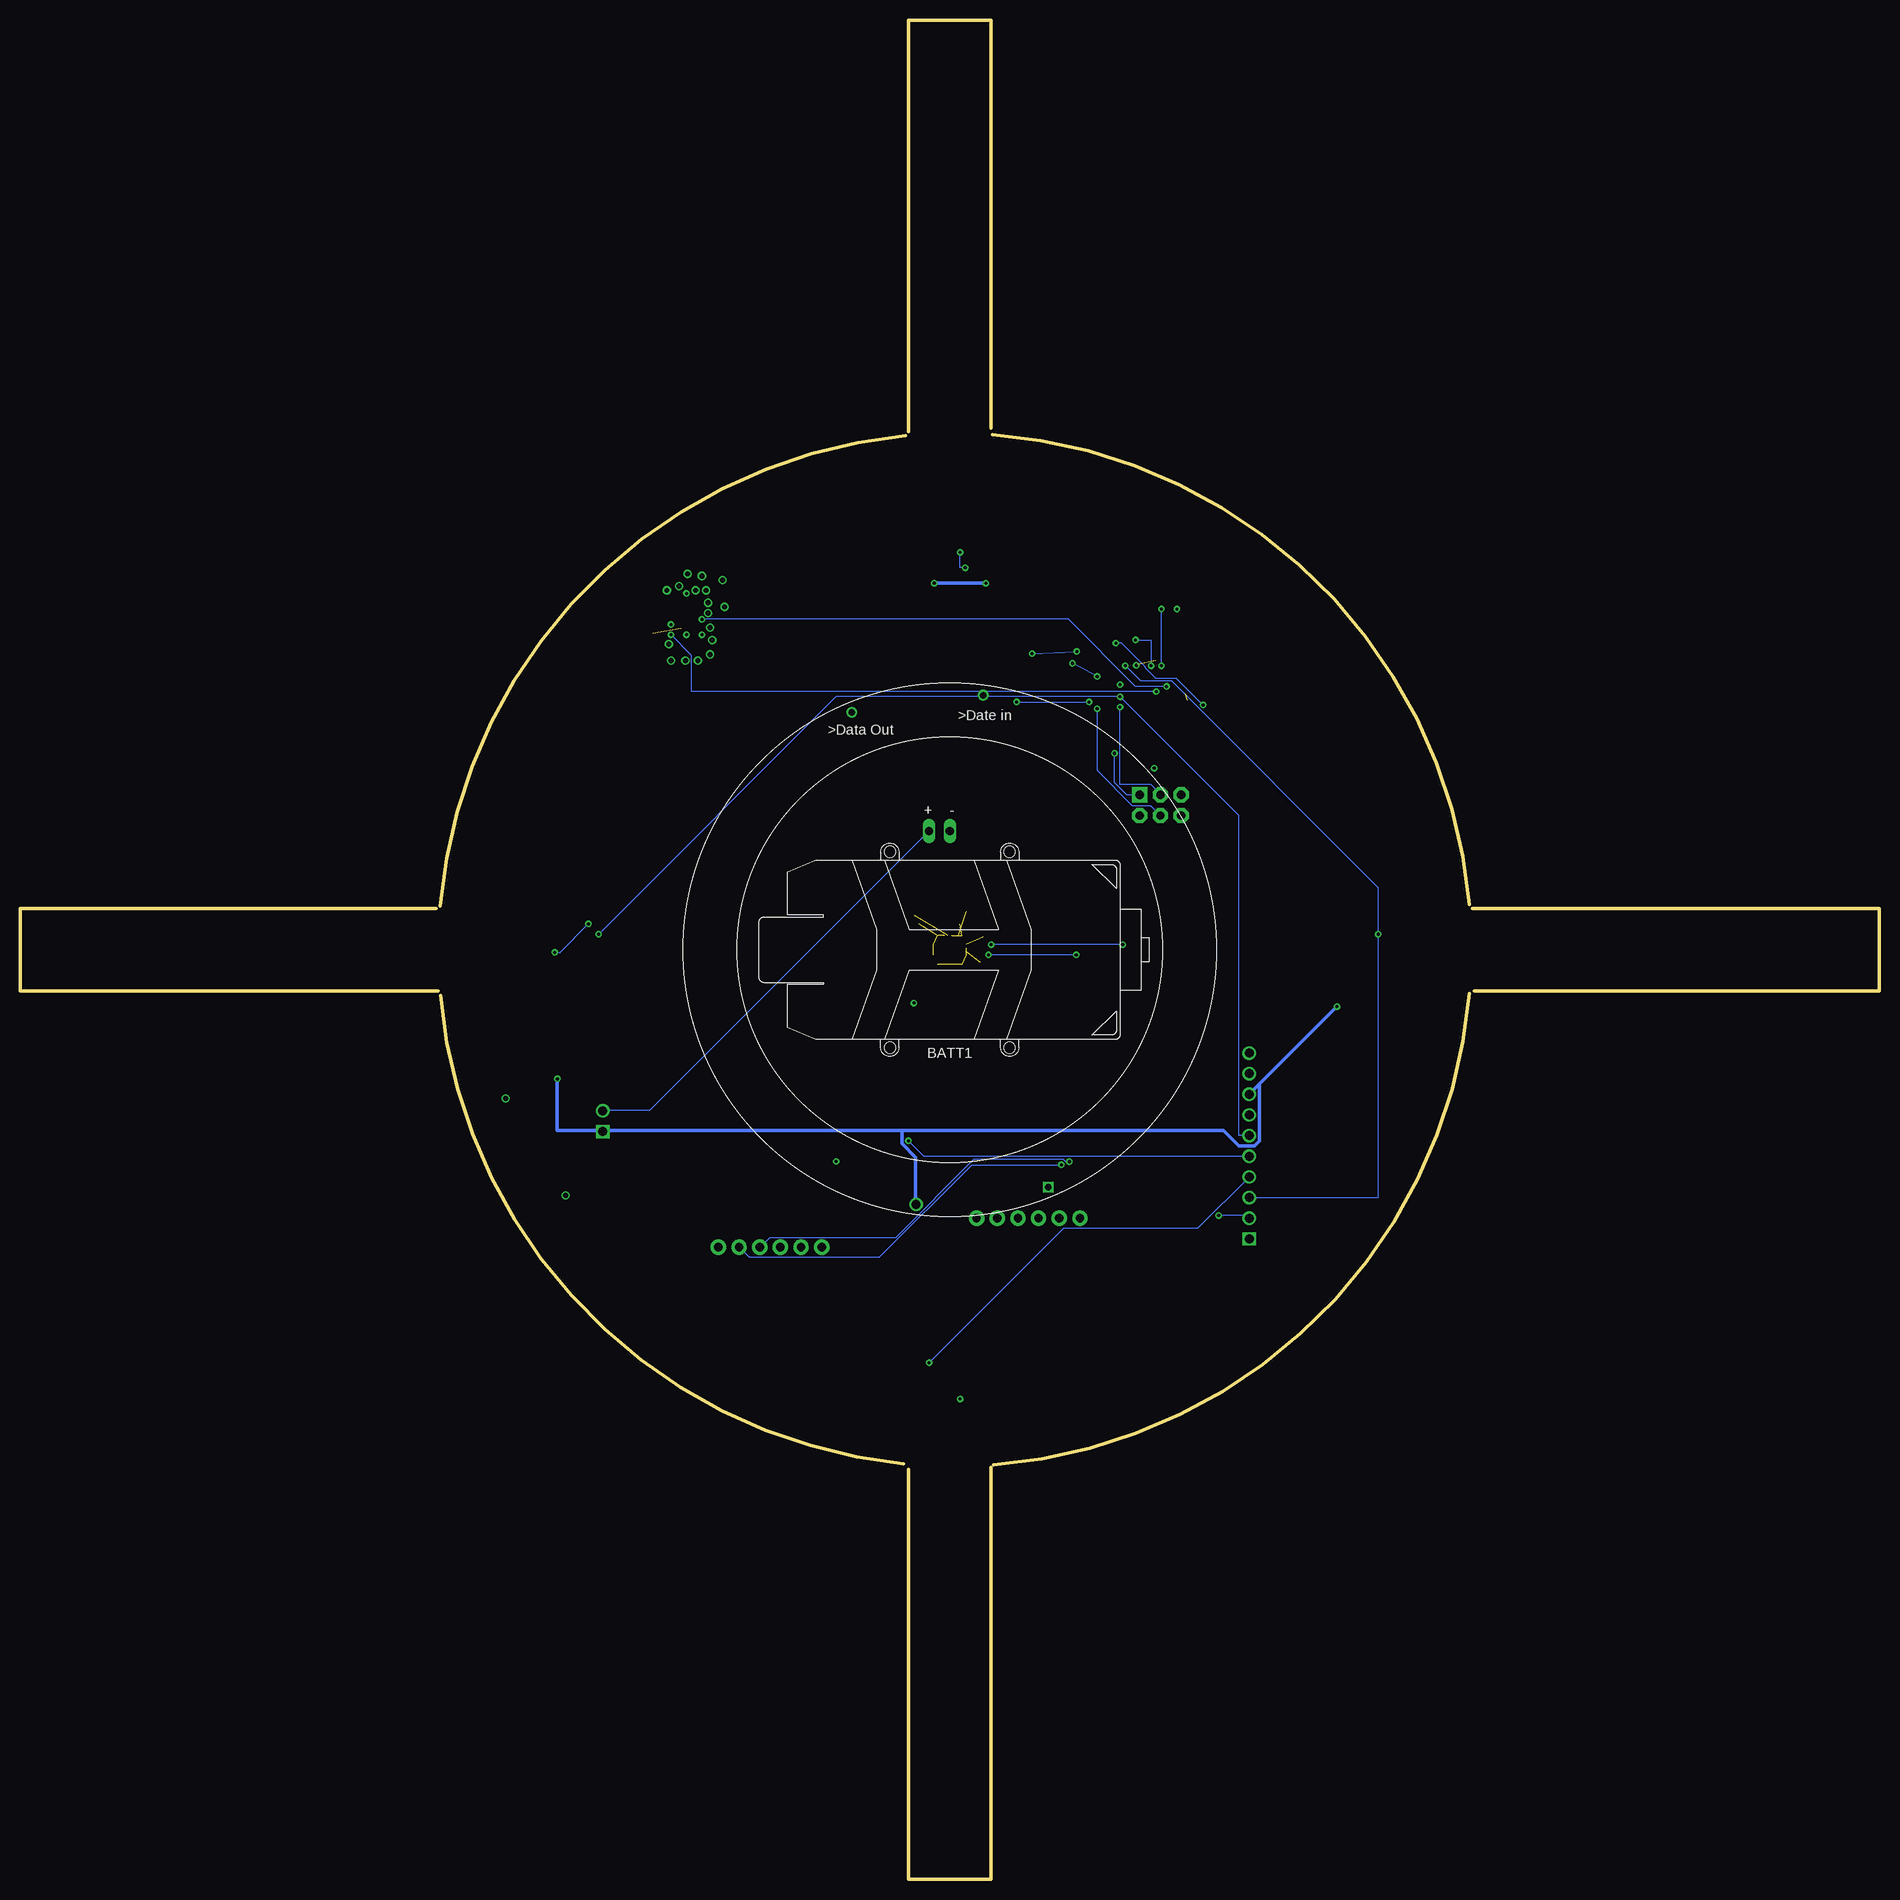
[diagram p4: board, bottom side, seen from below]

Size 228.6 x 228.6 mm. Coordinates in mm from the lower left corner, seen from the top.
Outline: 50.05,119.38 0,119.38 0,109.22 49.76,109.22
Outline: 177.48,119.38 228.6,119.38 228.6,109.22 177.19,109.22
Outline: 109.22,178.46 109.22,228.6 119.38,228.6 119.38,178.03
Outline: 50.4,119.86 arc-81 109.06,177.64
Outline: 119.73,177.51 arc-80 176.95,119.67
Outline: 176.93,108.7 arc-79 119.96,51.1
Outline: 119.38,50.39 119.38,0 109.22,0 109.22,50.65
Outline: 108.9,50.96 arc-81 50.38,108.91
Copper layers (1*2*15*16): Top 0.035559375mm / dielectric 1.501140625mm / Route2 0.035559375mm / dielectric 0.149859375mm / Route15 0.035559375mm / dielectric 0.200659375mm / Bottom 0.035559375mm
Design rules "<ZHE_JASON>4pcb-33board": minimum track width 6mil, minimum drill 15mil, track to track 6mil, track to pad 6mil, pad to pad 6mil, via to via 6mil, smd to smd 6mil, copper to edge 10mil, drill to drill 10mil, minimum pad ring 10mil, minimum via ring 8mil, stop-mask expansion 4mil, vias tented up to drill 0mil, thermal gap 10mil
tRestrict: area 151.6,141.7 to 167.6,163.3; area 112,112.3 to 116.8,116.1; 4 lines
bRestrict: area 151.6,141.7 to 167.6,163.3; area 112,112.8 to 116.6,116.1; area 109.2,144.5 to 111.5,146.6

### Footprints (pad centres in the part's own frame; a part is rotated, then mirrored left to right if it is on the bottom)
ANTENNA-CHIP5 = smd 1.016 x 2.54: FEED -3.302,0; NC 3.302,0
BALUN = smd 0.35 x 0.8: 1 -0.65,-0.8; 2 0,-0.8; 3 0.65,-0.8; 4 0.65,0.8; 5 0,0.8; 6 -0.65,0.8
BATTERY-W/HOLDER-380MAH-HUBSAN = drill 1 long: + -2.54,14.605; - 0,14.605 | hole 1.4: -7.35,-12.05; -7.35,12.05; 7.35,-12.05; 7.35,12.05
HDRV10W63P254_10X1_2540X254H838_HS = drill 1.1 pad 1.65 square: 1 0,0 | drill 1.1 pad 1.65: 2 2.54,0; 3 5.08,0; 4 7.62,0; 5 10.16,0; 6 12.7,0; 7 15.24,0; 8 17.78,0; 9 20.32,0; 10 22.86,0
CAPC2012X140_HS = smd 1.08 x 1.42: 1 -0.895,0; 2 0.895,0
CERAMIC_CAP_0805 = smd 1.08 x 1.42: 1 -0.895,0; 2 0.895,0
CAPMP7343X310_HS = smd 2.37 x 2.43: 1 -3.12,0; 2 3.12,0
SOD3716X135_HS = smd 1.25 x 0.8: A 1.665,0; C -1.665,0
2X3-NS = drill 1.016 pad 1.88 square: 1 -2.54,-1.27 | drill 1.016 pad 1.88 octagon: 2 -2.54,1.27; 3 0,-1.27; 4 0,1.27; 5 2.54,-1.27; 6 2.54,1.27
MALE_HEADER_2X1_0.1IN = drill 1.1 pad 1.65 square: 1 0,0 | drill 1.1 pad 1.65: 2 2.54,0
FTDI_BASIC = drill 1.016 pad 1.88: CTS 10.16,0; DTR 0,0; GND 12.7,0; RXI 2.54,0; TXO 5.08,0; VCC 7.62,0
LED_RING = drill 0.8: DATA_IN 4.14,31.318; DATA_OUT -12.065,29.21 | drill 0.8 square: GND 12.09,-29.185 | drill 1.1: PWR -4.14,-31.318
RESC2012X60_HS = smd 0.92 x 1.38: 1 -0.955,0; 2 0.955,0
QFN-64 = smd 1.562 x 0.28: 1 -4.881,3.75; 2 -4.881,3.25; 3 -4.881,2.75; 4 -4.881,2.25; 5 -4.881,1.75; 6 -4.881,1.25; 7 -4.881,0.75; 8 -4.881,0.25; 9 -4.881,-0.25; 10 -4.881,-0.75; 11 -4.881,-1.25; 12 -4.881,-1.75; 13 -4.881,-2.25; 14 -4.881,-2.75; 15 -4.881,-3.25; 16 -4.881,-3.75; 33 4.881,-3.75; 34 4.881,-3.25; 35 4.881,-2.75; 36 4.881,-2.25; 37 4.881,-1.75; 38 4.881,-1.25; 39 4.881,-0.75; 40 4.881,-0.25; 41 4.881,0.25; 42 4.881,0.75; 43 4.881,1.25; 44 4.881,1.75; 45 4.881,2.25; 46 4.881,2.75; 47 4.881,3.25; 48 4.881,3.75 | smd 0.28 x 1.562: 17 -3.75,-4.881; 18 -3.25,-4.881; 19 -2.75,-4.881; 20 -2.25,-4.881; 21 -1.75,-4.881; 22 -1.25,-4.881; 23 -0.75,-4.881; 24 -0.25,-4.881; 25 0.25,-4.881; 26 0.75,-4.881; 27 1.25,-4.881; 28 1.75,-4.881; 29 2.25,-4.881; 30 2.75,-4.881; 31 3.25,-4.881; 32 3.75,-4.881; 49 3.75,4.881; 50 3.25,4.881; 51 2.75,4.881; 52 2.25,4.881; 53 1.75,4.881; 54 1.25,4.881; 55 0.75,4.881; 56 0.25,4.881; 57 -0.25,4.881; 58 -0.75,4.881; 59 -1.25,4.881; 60 -1.75,4.881; 61 -2.25,4.881; 62 -2.75,4.881; 63 -3.25,4.881; 64 -3.75,4.881
MOTOR_PADS = smd 2 x 2: V+ -1,0; V- 2,0
N-CHANNELMOFSET = smd 0.559 x 1.724: P$1 0,1.484; P$2 -0.95,-1.484; P$3 0.95,-1.484
9-AXIS_IMU = smd 0.28 x 1.4: P$1 -1.53,1.775; P$6 -1.53,-1.775; P$7 -1.092,-1.775; P$8 -0.655,-1.775; P$9 -0.218,-1.775; P$10 0.219,-1.775; P$11 0.656,-1.775; P$12 1.093,-1.775; P$13 1.53,-1.775; P$18 1.53,1.775; P$19 1.093,1.775; P$20 0.656,1.775; P$21 0.219,1.775; P$22 -0.218,1.775; P$23 -0.655,1.775; P$24 -1.092,1.775 | smd 1.4 x 0.28: P$2 -1.97,0.67; P$3 -1.97,0.23; P$4 -1.97,-0.23; P$5 -1.97,-0.67; P$14 1.97,-0.67; P$15 1.97,-0.23; P$16 1.97,0.23; P$17 1.97,0.67
SOT23-DBV = smd 0.55 x 1.2: 1 -0.95,-1.3; 2 0,-1.3; 3 0.95,-1.3; 4 0.95,1.3; 5 -0.95,1.3
NET_BRIDGE = smd 1.422 x 0.711: P$1 -0.508,0; P$2 0.254,0
CRYSTAL-SMD-5X3 = smd 1.9 x 1.1: 1 -1.85,-1.15; 2 1.85,-1.15; 3 1.85,1.15; 4 -1.85,1.15

### Placement (x,y rotation side)
A1  154.18,153.16 0 top
B1  146.56,154.43 90 top
BATT1  114.3,114.3 0 bottom
BREAKOUT_HEADER  77.47,78.74 90 top
C5  138.68,92.46 180 top
C6  138.68,94.74 180 top
C7  64.01,113.54 0 top
C8  146.56,156.97 0 top
C9  162.81,114.3 180 top
C10  111,86.36 0 top
C11  59.44,114.55 90 top
C12  146.56,151.89 180 top
C13  113.03,165.35 90 top
C14  114.05,169.93 0 top
C15  113.28,63.5 90 top
C16  114.3,58.93 180 top
C17  114.55,109.98 0 top
C18  167.89,113.79 90 top
C19  107.95,120.14 90 top
C20  112.27,119.89 90 top
C21  115.82,120.14 270 top
C22  118.62,117.6 90 top
C23  152.65,85.09 90 top
C24  152.65,88.9 270 top
C25  144.78,87.63 270 top
C26  90.42,154.18 90 top
C27  92.46,154.18 90 top
C28  89.15,137.67 0 top
C29  88.39,154.18 270 top
D1  64.77,111 0 top
D2  110.62,164.47 90 top
D3  111,64.26 90 top
D4  161.8,118.11 0 top
J1  88.39,132.08 180 top
J2  156.97,91.95 90 top
JP1  111,81.28 180 top
JP2  142.75,77.72 180 top
LR1  114.3,114.3 0 bottom
R1  86.36,154.18 90 top
R2  107.7,115.06 0 top
R3  107.95,112.01 0 top
R4  64.01,115.82 0 top
R5  162.31,108.97 0 top
R6  64.01,118.11 0 top
R7  117.6,165.35 90 top
R8  115.32,165.35 90 top
R9  117.6,63.5 90 top
R10  115.57,63.5 90 top
R12  162.31,111.25 0 top
U1  90.17,145.03 0 top
U$1  153.67,111.76 270 top
U$2  155.7,117.86 270 top
U$3  114.3,114.3 0 top
U$4  68.58,116.59 270 top
U$5  70.36,111.25 90 top
U$6  115.06,161.04 0 top
U$7  110.74,158.75 0 top
U$8  115.82,69.34 180 top
U$9  111,69.6 180 top
U$10  148.59,87.38 270 top
U$11  162.05,93.47 90 top
Y1  90.68,158.5 180 top

### Tracks (layer width: path | path; a pad name or v marks a point on that pad's centre or on a via)
BAT_GND
  Top 0.152: C15.2 113.66,64.77 115.57,62.86 R10.1 115.57,61.59 112.39,61.59 111.76,62.23 111.76,63.5 109.22,66.04 109.22,69.85 | 109.22,69.85 109.85,70.48 U$9.P$3 109.85,71.12 137.29,98.55 | R6.1 63.5,118.11 64.13,117.47 64.13,114.3 64.77,113.66 C7.2 65.41,113.66 66.04,114.3 66.04,117.47 67.94,119.38 71.75,119.38 71.75,112.39 U$5.P$3 72.39,112.39 76.2,108.58 76.2,100.33 | BREAKOUT_HEADER.9 76.2,100.33 | 109.22,69.85 76.2,69.85 76.2,100.33 | 113.03,166.37 114.94,164.47 R8.1 115.57,164.47 115.57,157.48 111.76,157.48 U$7.P$3 | R5.1 162.56,113.03 163.07,111.12 C9.2 161.93,110.49 161.93,105.41 | 161.93,105.41 161.93,93.98 U$11.P$2 | 161.93,105.41 156.21,111.12 156.21,115.57 155.57,116.2 U$2.P$3 154.94,116.2 | 113.03,166.37 114.3,167.64 139.7,167.64 139.7,131.44 154.94,116.2 | 113.03,166.37 C13.2 | 154.94,116.2 137.29,98.55 | 137.29,98.55 140.36,95.48 140.36,91.21 144.47,87.1 144.47,86.79 C25.2
GND  (via drill 0.38, 0.6)  (8 unrouted)
  Top 0.152: 87.63,142.24 87.63,141.96 | 87.63,141.96 87.63,140.97 U1.20 | 89.53,142.24 87.63,142.24 | 89.53,142.11 89.53,140.97 U1.24 89.53,140.34 89.53,137.79 C28.2 90.17,137.16 92.71,134.62 92.71,132.72 92.07,132.08 86.36,132.08 86.36,130.81 J1.6 | 89.53,142.11 89.53,142.24 | C27.2 92.07,154.94 90.8,154.94 C26.2 90.17,154.94 88.9,153.67 C29.2 88.27,153.03 87.63,152.4 87.63,151.71 | 87.63,151.71 87.63,151.13 U1.61 87.63,150.5 87.63,147.95 89.53,147.95 | 89.53,147.95 90.68,147.95 | 90.68,147.95 94.61,147.95 U1.45 | 89.53,147.95 89.53,142.24 | 148.59,87.63 152.4,87.63 C24.2 153.03,87.63 153.03,86.36 C23.2 | 148.59,87.63 147.32,87.63 U$10.2 | C6.1 139.7,94.61 139.7,92.71 C5.1 139.7,92.07 139.7,91.44 143.69,87.45 | 143.69,87.45 144.14,87 | 148.59,87.63 148.59,86.36 147.95,85.72 144.78,85.72 144.78,85.95 | 144.78,86.36 144.78,85.95 | 144.14,156.84 144.14,155.57 v144.02,155.7 | 144.14,156.84 144.14,158.12 v144.27,158.5 | 144.14,156.84 v144.02,156.97 | B1.5 145.41,154.31 143.51,154.31 v143.76,153.92 | 148.34,151.38 148.59,151.13 v148.59,149.86 | 148.34,151.38 147.95,151.76 C12.1 | C8.2 147.95,157.48 147.95,158.75 v147.57,159 | 161.93,92.71 168.91,92.71 168.91,95.88 | BREAKOUT_HEADER.10 77.47,120.02 62.86,120.02 60.96,118.11 59.69,118.11 C11.2 | v113.03,59.05 111.76,59.05 C16.2 | C14.2 117.47,169.54 140.34,169.54 140.34,161.29 140.46,161.29 | 168.91,95.88 169.54,96.52 169.54,115.57 168.28,116.84 C18.2 | 168.91,95.88 v168.91,96.01 | 148.59,87.63 148.59,88.27 151.13,90.8 161.93,90.8 161.93,92.71 | 161.93,92.71 U$11.P$1 | U1.35 94.87,143.03 95.63,143.03 95.86,142.8 95.86,142.34 95.63,142.11 94.87,142.11 U1.33 94.79,142.11 89.53,142.11
  Top 0.152: U1.17 86.18,140.89 86.64,140.89 U1.18 86.72,140.97 86.72,141.73 86.94,141.96 87.63,141.96 | U1.10 85.04,145.01 85.04,144.55 U1.11 85.11,144.55 85.8,144.55 87.63,142.72 87.63,142.24 | 87.63,151.71 88.92,151.71 89.15,151.49 89.15,150.72 U1.58 | 90.68,147.95 90.68,150.65 U1.55 | 144.78,85.95 143.87,85.95 143.56,86.26 143.56,87.25 143.64,87.32 143.64,87.4 143.69,87.45 | 148.34,151.38 v148.84,151.89 | C19.2 109.54,120.33 112.39,120.33 C20.2 112.71,120.33 114.3,120.33 | 114.3,120.33 115.25,120.33 C21.1 115.57,120.02 118.11,117.47 | C22.1 118.11,117.47 | 118.11,117.47 118.11,110.81 C17.2 | BATT1.- 114.3,120.33
  other vias: 145.54,158.5 143.51,152.4 143.76,150.62 145.29,149.86 144.78,160.27 146.56,160.53 141.99,156.46 146.81,149.86 142.24,159.77 149.1,158.5
  pour Route2: 140.97,141.22 168.4,141.22 arc-70 155.19,71.88 arc-50 115.57,54.61 arc-180 111.25,175.77 arc-40 140.97,165.35
  pour Top: 150.88,161.29 140.46,161.54 140.46,147.07 148.84,146.81 149.1,149.61 143.51,149.61 143.26,158.75 149.35,158.75 149.61,150.62 150.62,150.62
  pour Route2: 149.1,146.56 138.94,146.56 138.94,162.81 151.13,162.81 151.13,149.35 149.61,149.35 149.61,158.75 143.51,158.75 143.51,149.61 149.1,149.61
MISO  (via drill 0.38)
  Top 0.152: v94.03,138.45 96.85,141.28 96.85,144.17 96.01,145.01 94.87,145.01 U1.39
  Bottom 0.152: v94.03,138.45 94.03,134.87 92.51,133.35 J1.1
MOSI  (via drill 0.38)
  Top 0.152: v96.16,143.94 95.63,144.47 94.87,144.47 U1.38
  Bottom 0.152: v96.16,143.94 96.16,136.32 91.82,131.98 89.53,131.98 88.39,130.84 J1.4
N$1  (via drill 0.38)
  Top 0.152: R12.2 164.29,115.06 164.29,113.08 R5.2 164.21,113 164.21,110.8 163.23,114.31 | 163.23,114.31 C9.1 | v158.75,117.47 158.75,117.79 157.48,117.79 U$2.P$1 | v162.88,113.98 163.19,114.3 163.23,114.31
  Bottom 0.152: v158.75,117.47 162.24,113.98 v162.88,113.98
N$2
  Top 0.152: R4.2 65.41,116.2 65.41,118.11 R6.2 64.77,118.11 64.77,119.38 62.86,119.38 60.96,117.47 60.96,115.57 | 60.96,115.57 62.86,113.66 C7.1 | 60.96,115.57 57.78,112.39 57.78,106.68 67.31,106.68 67.31,109.85 68.58,111.12 U$5.P$1
N$3
  cutout Route2: 151.38,163.83 151.64,141.73 169.67,141.99 161.54,154.94
  cutout Route15: 151.38,163.83 151.64,141.73 169.67,141.99 161.54,154.94
N$4  (via drill 0.38)  (1 unrouted)
  Top 0.457: v146.69,153.03 147.32,153.67 B1.1 | v146.69,158.12 146.05,157.48 C8.1
  Route2 0.457: v146.69,158.12 v146.69,153.03
N$8  (via drill 0.38)
  Top 0.152: v148.59,154.31 147.32,154.31 B1.2 | v144.78,153.03 145.41,152.4 C12.2
  Route2 0.152: v148.59,154.31 147.32,153.03 147.32,152.4 145.41,152.4 v144.78,153.03
N$10
  Top 0.152: C10.1 110.49,86.36 110.49,81.28 JP1.DTR
N$13
  Top 0.152: 68.58,113.66 U$4.V- 68.58,114.3 | 68.58,113.66 68.58,113.03 66.67,111.12 D1.A | 68.58,113.66 71.75,110.49 U$5.P$2
N$14  (via drill 0.38)
  Top 0.152: R8.2 115.57,166.37 117.47,166.37 R7.2 118.11,166.37 118.75,165.74 118.75,160.02 114.3,155.57 110.49,155.57 110.49,160.02 U$7.P$1 110.49,160.66 110.49,161.29 v112.39,161.29 | v113.03,163.19 C13.1
  Bottom 0.152: v113.03,163.19 113.03,161.29 v112.39,161.29
N$16
  Top 0.152: 156.84,118.11 155.57,118.11 U$2.P$2 | 156.84,118.11 161.29,118.11 161.93,117.47 163.83,117.47 D4.A | 156.84,118.11 156.84,111.76 158.75,111.76 U$1.V-
N$17  (via drill 0.38)
  Top 0.457: 109.22,159.38 109.22,158.12 109.85,157.48 U$7.P$2 | 109.22,159.38 109.22,164.47 110.49,165.74 D2.A | v116.2,159.38 116.2,160.02 116.84,160.66 U$6.V- | 109.22,159.38 v109.85,159.38
  Bottom 0.457: v109.85,159.38 v116.2,159.38
N$18
  Top 0.152: 115.57,64.77 117.47,64.77 R9.2 | 111.76,66.04 111.76,67.31 111.12,67.94 U$9.P$1 | 111.76,66.04 111.76,64.13 113.03,62.86 C15.1 | 115.57,64.77 114.3,66.04 111.76,66.04 | 115.57,64.77 R10.2
N$19
  Top 0.152: 111.76,70.48 109.85,68.58 109.85,67.31 111.12,66.04 D3.A | 111.76,70.48 111.76,69.85 113.66,67.94 U$8.V- | 111.76,70.48 U$9.P$2
N$21  (1 unrouted)
N$23  (1 unrouted)
N$24
  Top 0.152: 90.17,151.76 90.17,151.13 U1.56 | 90.17,151.76 90.17,153.03 C26.1 | 90.17,151.76 92.71,151.76 94.61,153.67 94.61,157.48 92.71,159.38 Y1.1
N$25
  Bottom 0.152: BATT1.+ 151.13,94.61 156.84,94.61 J2.2
N$26
  Top 0.152: D3.C 111.12,62.23 114.3,59.05 116.84,59.05 C16.1 117.47,59.05 118.75,60.32 118.75,66.04 117.47,67.31 U$8.V+
N$27
  Top 0.152: U$10.4 149.86,86.36 152.4,83.82 C23.1
N$36  (via drill 0.38)
  Top 0.152: v144.78,154.94 145.41,154.94 B1.4 | v87.63,146.69 86.36,146.69 86.36,146.05 85.09,146.05 U1.8
  Bottom 0.152: v144.78,154.94 99.69,154.94 91.44,146.69 v87.63,146.69
N$37  (via drill 0.38)
  Top 0.152: v148.59,153.03 149.22,153.67 149.22,154.94 147.32,154.94 B1.3 | v88.9,146.05 87,146.05 86.36,145.41 85.09,145.41 U1.9
  Bottom 0.152: v148.59,153.03 146.05,150.5 146.05,146.05 v88.9,146.05
N$40  (via drill 0.38)
  Top 0.152: v88.27,156.21 88.27,155.57 C29.1 | v88.27,149.22 88.27,150.5 U1.60
  Bottom 0.152: v88.27,149.22 v88.27,156.21
N$41
  Top 0.152: C28.1 88.27,137.79 88.27,140.34 U1.21 88.24,140.89 88.62,140.89 U1.22
N$43  (via drill 0.38)
  Top 0.152: Y1.3 88.9,156.84 88.9,156.21 93.34,156.21 93.98,155.57 93.98,154.94 92.71,153.67 C27.1 92.07,153.03 v91.44,152.4 | v89.53,149.22 89.53,150.5 U1.57
  Bottom 0.152: v89.53,149.22 89.53,152.4 v91.44,152.4
PB4  (via drill 0.38)
  Top 0.152: v97.16,144.78 96.39,145.54 94.87,145.54 U1.40 | v106.07,144.78 109.27,144.78 110.11,145.62 LR1.DATA_IN
  Bottom 0.152: v106.07,144.78 v97.16,144.78
PB5  (via drill 0.38)
  Top 0.152: 163.83,115.57 165.86,114.55 R12.1 161.93,114.94 161.29,114.3 161.54,115.82 157.73,115.82 v157.48,116.2 157.48,116.84 158.12,117.47 | v93.34,145.41 93.34,146.05 94.61,146.05 U1.41
  Bottom 0.152: BREAKOUT_HEADER.6 78.74,91.44 78.74,130.81 v93.34,145.41 128.27,145.41 v157.48,116.2
PE3  (via drill 0.38)
  Top 0.152: v119.38,90.8 119.38,150.72 | 119.38,150.72 119.38,167 114.3,167 114.3,165.74 114.94,165.1 116.2,165.1 116.84,164.47 117.47,164.47 R7.1 | v98.68,150.98 93.73,150.72 U1.49 | 119.38,150.72 v104.16,150.72
  Bottom 0.152: v119.38,90.8 117.47,88.9 BREAKOUT_HEADER.5 | v104.16,150.72 v98.68,150.98
PE4  (via drill 0.38)
  Top 0.152: v116.84,63.5 117.47,62.86 R9.1 | v93.88,152.02 93.73,152.02 93.19,151.49 93.19,150.72 U1.50 | v83.13,144.4 83.13,92.05 77.5,86.41 BREAKOUT_HEADER.4
  Bottom 0.152: v116.84,63.5 100.33,80.01 83.82,80.01 BREAKOUT_HEADER.4 | v93.88,152.02 93.19,152.02 90.22,149.05 90.22,148.97 88.92,147.68 86.41,147.68 v83.13,144.4
PE5  (via drill 0.38)
  Top 0.152: v61.59,116.2 62.86,116.2 R4.1 | v92.71,149.22 92.71,150.5 U1.51
  Bottom 0.152: BREAKOUT_HEADER.3 61.59,83.82 v61.59,116.2 61.59,121.92 87,147.32 90.8,147.32 v92.71,149.22
RESET
  Top 0.152: 85.09,151.76 83.82,150.5 83.82,144.14 | 85.09,151.76 86.36,153.03 R1.1 | 83.82,144.14 84.45,144.14 U1.12 | 85.09,151.76 85.09,160.66 93.34,160.66 105.41,148.59 105.41,92.71 111.76,86.36 C10.2 | 83.82,144.14 83.82,135.25 85.72,133.35 J1.5
RX0
  Top 0.152: U1.46 95.25,148.59 104.77,148.59 104.77,81.91 105.41,81.28 JP1.TXO
RX1  (via drill 0.38)
  Top 0.152: v99.59,88.24 99.59,130.53 91.21,138.91 91.21,140.89 U1.27
  Bottom 0.152: v99.59,88.24 100.05,88.24 100.35,88.54 111.33,88.54 120.93,78.94 136.4,78.94 137.62,77.72 JP2.TXO
SCK  (via drill 0.38)
  Top 0.152: v93.34,144.14 94.61,144.14 U1.37
  Bottom 0.152: v93.34,144.14 93.34,134.62 89.53,134.62 88.27,133.35 J1.3
SCL  (via drill 0.38)  (1 unrouted)
  Top 0.152: 93.34,114.94 93.34,94.61 BREAKOUT_HEADER.1 | 93.34,114.94 93.34,135.89 90.17,139.06 90.17,140.34 U1.25 | v109.22,114.94 110.17,115.89 R2.2 | 93.34,114.94 v93.03,114.94
  Bottom 0.152: v93.03,114.94 v109.22,114.94
SDA  (via drill 0.38)  (1 unrouted)
  Top 0.152: 93.65,113.66 93.65,94.03 v81.23,81.61 | 93.65,113.66 93.65,136.02 90.68,138.99 90.68,140.89 U1.26 | v109.54,113.66 110.49,112.71 R3.2 | 93.65,113.66 v98.74,113.66
  Bottom 0.152: v81.23,81.61 77.8,81.61 BREAKOUT_HEADER.2 | v98.74,113.66 v109.54,113.66
TX0  (via drill 0.38)
  Top 0.152: v99.21,149.53 95.94,149.05 94.87,149.05 U1.47 | v96.16,147.9 96.16,146.69 101.27,141.58 101.27,82.53 102.18,81.61 102.18,80.77 102.87,80.09 107.29,80.09 108.43,81.23 JP1.RXI
  Bottom 0.152: v96.16,147.9 v99.21,149.53
TX1  (via drill 0.38)
  Top 0.152: v100.58,87.86 100.58,130 91.67,138.91 91.67,140.89 U1.28
  Bottom 0.152: v100.58,87.86 111.56,87.86 122.91,76.5 138.99,76.5 JP2.RXI
V3  (via drill 0.38, 0.6)  (9 unrouted)
  Top 0.152: U$10.5 149.86,88.27 151.13,88.27 152.4,89.53 C24.1 153.03,89.53 161.29,89.53 161.29,84.45 v161.54,84.07 | v86.36,156.21 R1.2 | C6.2 137.79,94.61 137.79,92.71 C5.2 137.79,92.07 137.79,88.27 v128.27,88.27 | U1.34 94.79,142.57 93.95,142.57 92.66,143.87 92.66,146.23 v93.34,146.91 93.95,147.52 94.79,147.52 U1.44 | v89.15,136.63 89.15,140.89 U1.23 | v91.36,149.28 91.21,149.43 91.21,150.65 U1.54 | v118.72,107.75 118.41,108.05 118.41,108.81 C17.1 118.11,108.9 116.2,108.9 112.71,112.39 | 109.22,117.47 109.22,118.43 C19.1 | 109.22,117.47 109.22,116.84 108.58,116.2 R2.1 108.58,115.89 108.58,112.71 R3.1 108.9,112.39 108.9,111.12 111.44,111.12 112.71,112.39 | 109.22,117.47 113.03,117.47 113.66,118.11 113.66,118.43 115.25,118.43 C21.2 | 112.71,112.39 U$3.P$6
  pour Route15: 129.03,130.56 169.93,130.56 arc-70 154.94,71.88 arc-50 115.06,52.83 arc-180 111,175.77 arc-60 128.52,168.66
VBAT  (via drill 0.38)
  Top 0.457: 159.38,116.2 159.38,114.3 U$1.V+ | 159.38,116.2 159.38,116.84 160.02,117.47 D4.C | 159.38,116.2 165.1,116.2 165.74,115.57 165.74,113.03 167.64,111.12 C18.1 167.64,110.49 162.56,105.41 v162.56,98.42 | 144.78,88.27 146.05,87 146.05,86.36 147.32,86.36 U$10.3 | 144.78,88.27 147.32,88.27 | 144.78,88.27 C25.1 | 147.32,88.27 150.5,91.44 156.84,91.44 J2.1 | 147.32,88.27 U$10.1 | 111.76,162.56 112.39,162.56 113.66,161.29 U$6.V+ | 111.76,162.56 110.49,162.56 D2.C | 111.76,162.56 111.76,168.91 111.12,169.54 C14.1 110.49,169.54 84.45,169.54 84.45,152.4 78.74,146.69 78.74,97.79 BREAKOUT_HEADER.8 | C11.1 59.69,111.12 62.86,111.12 D1.C 63.5,111.12 64.13,111.12 | 64.13,111.12 66.67,113.66 66.67,115.57 68.58,117.47 U$4.V+ | v66.67,107.31 64.13,109.85 64.13,111.12
  Bottom 0.457: v162.56,98.42 162.56,92.07 157.48,92.07 J2.1 156.84,92.07 120.17,92.07 | v66.67,107.31 76.2,97.79 | 76.2,97.79 BREAKOUT_HEADER.8 | 120.17,92.07 80.64,92.07 78.74,90.17 76.83,90.17 76.2,90.8 76.2,97.79 | 120.17,92.07 120.17,90.45 118.49,88.77 118.49,82.98 LR1.PWR
  pour Route15: 85.34,80.77 arc90 158.24,87.38 171.2,115.57 arc-70 129.79,59.18 114.55,55.12 114.55,54.61 114.05,54.61 111,55.88 arc-180 117.35,174.24 arc45 85.34,159.51 arc90

### Text on the board
tPlace: GND | BAT_GND | VBAT | V3 | PB5 | PE3 | PE4 | PE5 | SDA | SCL